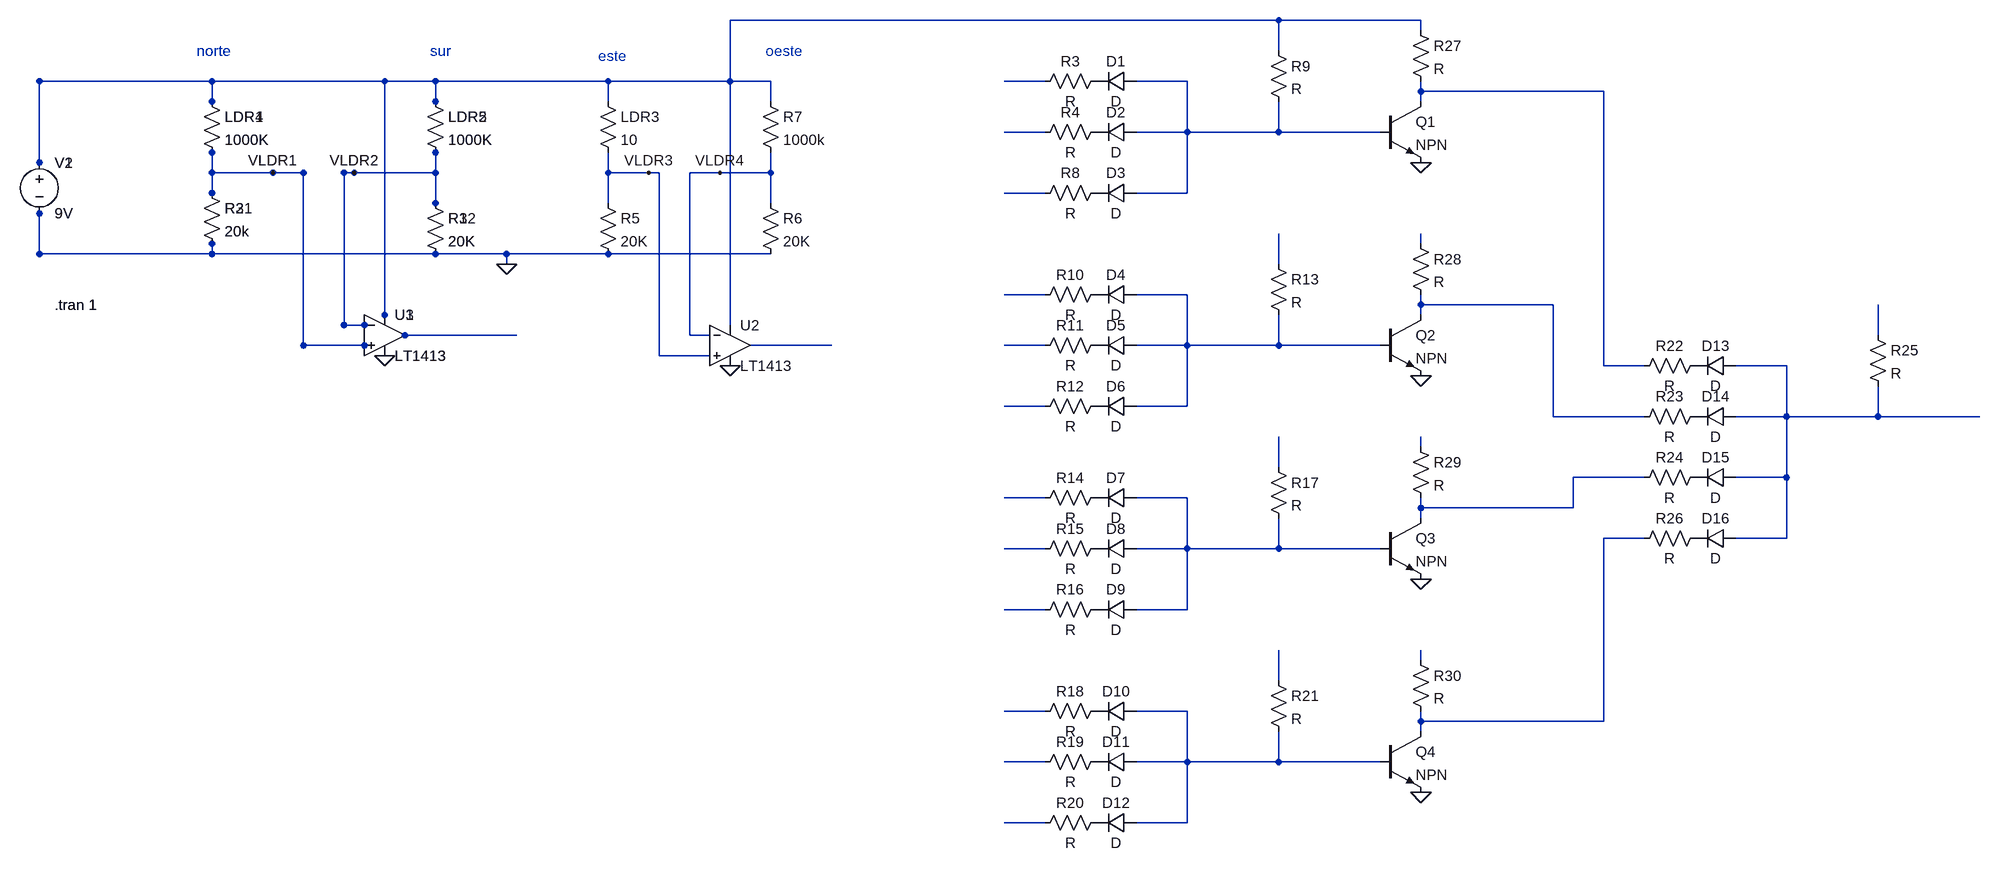
[diagram p0: schematic idea1_tp8.asc]
idea1_tp8.asc, the LTspice schematic file:
Version 4
SHEET 1 3108 1200
WIRE 2000 -112 1136 -112
WIRE 2224 -112 2000 -112
WIRE 2224 -96 2224 -112
WIRE 2000 -64 2000 -112
WIRE 320 -16 48 -16
WIRE 592 -16 320 -16
WIRE 672 -16 592 -16
WIRE 944 -16 672 -16
WIRE 1136 -16 1136 -112
WIRE 1136 -16 944 -16
WIRE 1200 -16 1136 -16
WIRE 1632 -16 1568 -16
WIRE 1856 -16 1776 -16
WIRE 2224 0 2224 -16
WIRE 2512 0 2224 0
WIRE 320 16 320 -16
WIRE 672 16 672 -16
WIRE 944 16 944 -16
WIRE 1200 16 1200 -16
WIRE 2224 16 2224 0
WIRE 1632 64 1568 64
WIRE 1856 64 1856 -16
WIRE 1856 64 1776 64
WIRE 2000 64 2000 16
WIRE 2000 64 1856 64
WIRE 2160 64 2000 64
WIRE 48 112 48 -16
WIRE 320 128 320 96
WIRE 416 128 320 128
WIRE 464 128 416 128
WIRE 544 128 528 128
WIRE 672 128 672 96
WIRE 672 128 544 128
WIRE 944 128 944 96
WIRE 1008 128 944 128
WIRE 1024 128 1008 128
WIRE 1120 128 1072 128
WIRE 1200 128 1200 96
WIRE 1200 128 1120 128
WIRE 320 160 320 128
WIRE 1632 160 1568 160
WIRE 1856 160 1856 64
WIRE 1856 160 1776 160
WIRE 672 176 672 128
WIRE 944 176 944 128
WIRE 1200 176 1200 128
WIRE 2224 240 2224 224
WIRE 48 256 48 192
WIRE 320 256 320 240
WIRE 320 256 48 256
WIRE 672 256 320 256
WIRE 784 256 672 256
WIRE 944 256 784 256
WIRE 1200 256 944 256
WIRE 784 272 784 256
WIRE 2000 272 2000 224
WIRE 1632 320 1568 320
WIRE 1856 320 1776 320
WIRE 2224 336 2224 320
WIRE 2432 336 2224 336
WIRE 592 352 592 -16
WIRE 2224 352 2224 336
WIRE 528 368 528 128
WIRE 560 368 528 368
WIRE 1136 368 1136 -16
WIRE 800 384 624 384
WIRE 1072 384 1072 128
WIRE 1104 384 1072 384
WIRE 2944 384 2944 336
WIRE 464 400 464 128
WIRE 560 400 464 400
WIRE 1296 400 1168 400
WIRE 1632 400 1568 400
WIRE 1856 400 1856 320
WIRE 1856 400 1776 400
WIRE 2000 400 2000 352
WIRE 2000 400 1856 400
WIRE 2160 400 2000 400
WIRE 1024 416 1024 128
WIRE 1104 416 1024 416
WIRE 2512 432 2512 0
WIRE 2576 432 2512 432
WIRE 2800 432 2720 432
WIRE 1632 496 1568 496
WIRE 1856 496 1856 400
WIRE 1856 496 1776 496
WIRE 2432 512 2432 336
WIRE 2576 512 2432 512
WIRE 2800 512 2800 432
WIRE 2800 512 2720 512
WIRE 2944 512 2944 464
WIRE 2944 512 2800 512
WIRE 3104 512 2944 512
WIRE 2224 560 2224 544
WIRE 2000 592 2000 544
WIRE 2576 608 2464 608
WIRE 2800 608 2800 512
WIRE 2800 608 2720 608
WIRE 1632 640 1568 640
WIRE 1856 640 1776 640
WIRE 2224 656 2224 640
WIRE 2464 656 2464 608
WIRE 2464 656 2224 656
WIRE 2224 672 2224 656
WIRE 2576 704 2512 704
WIRE 2800 704 2800 608
WIRE 2800 704 2720 704
WIRE 1632 720 1568 720
WIRE 1856 720 1856 640
WIRE 1856 720 1776 720
WIRE 2000 720 2000 672
WIRE 2000 720 1856 720
WIRE 2160 720 2000 720
WIRE 1632 816 1568 816
WIRE 1856 816 1856 720
WIRE 1856 816 1776 816
WIRE 2224 896 2224 880
WIRE 2000 928 2000 880
WIRE 1632 976 1568 976
WIRE 1856 976 1776 976
WIRE 2224 992 2224 976
WIRE 2512 992 2512 704
WIRE 2512 992 2224 992
WIRE 2224 1008 2224 992
WIRE 1632 1056 1568 1056
WIRE 1856 1056 1856 976
WIRE 1856 1056 1776 1056
WIRE 2000 1056 2000 1008
WIRE 2000 1056 1856 1056
WIRE 2160 1056 2000 1056
WIRE 1632 1152 1568 1152
WIRE 1856 1152 1856 1056
WIRE 1856 1152 1776 1152
WIRE 320 -16 48 -16
WIRE 592 -16 320 -16
WIRE 672 -16 592 -16
WIRE 320 16 320 -16
WIRE 672 16 672 -16
WIRE 48 112 48 -16
WIRE 320 128 320 96
WIRE 416 128 320 128
WIRE 464 128 416 128
WIRE 544 128 528 128
WIRE 672 128 672 96
WIRE 672 128 544 128
WIRE 320 160 320 128
WIRE 672 176 672 128
WIRE 48 256 48 192
WIRE 320 256 320 240
WIRE 320 256 48 256
WIRE 672 256 320 256
WIRE 784 256 672 256
WIRE 784 272 784 256
WIRE 592 352 592 -16
WIRE 528 368 528 128
WIRE 560 368 528 368
WIRE 800 384 624 384
WIRE 464 400 464 128
WIRE 560 400 464 400
FLAG 592 416 0
FLAG 1136 432 0
FLAG 784 272 0
FLAG 416 128 VLDR1
FLAG 544 128 VLDR2
FLAG 1008 128 VLDR3
FLAG 1120 128 VLDR4
FLAG 2224 112 0
FLAG 2224 448 0
FLAG 2224 768 0
FLAG 2224 1104 0
FLAG 592 416 0
FLAG 784 272 0
FLAG 416 128 VLDR1
FLAG 544 128 VLDR2
SYMBOL voltage 48 96 R0
WINDOW 123 0 0 Left 0
WINDOW 39 0 0 Left 0
SYMATTR InstName V1
SYMATTR Value 9V
SYMBOL res 304 0 R0
SYMATTR InstName LDR1
SYMATTR Value 1000K
SYMBOL res 304 144 R0
SYMATTR InstName R2
SYMATTR Value 20k
SYMBOL res 656 160 R0
SYMATTR InstName R1
SYMATTR Value 20K
SYMBOL res 656 0 R0
SYMATTR InstName LDR2
SYMATTR Value 1000K
SYMBOL res 928 0 R0
SYMATTR InstName LDR3
SYMATTR Value 10
SYMBOL res 928 160 R0
SYMATTR InstName R5
SYMATTR Value 20K
SYMBOL res 1184 160 R0
SYMATTR InstName R6
SYMATTR Value 20K
SYMBOL res 1184 0 R0
SYMATTR InstName R7
SYMATTR Value 1000k
SYMBOL OpAmps\\LT1413 592 320 R0
SYMATTR InstName U1
SYMBOL OpAmps\\LT1413 1136 336 R0
SYMATTR InstName U2
SYMBOL res 1728 -32 R90
WINDOW 0 0 56 VBottom 2
WINDOW 3 32 56 VTop 2
SYMATTR InstName R3
SYMBOL diode 1776 -32 R90
WINDOW 0 0 32 VBottom 2
WINDOW 3 32 32 VTop 2
SYMATTR InstName D1
SYMBOL res 1728 48 R90
WINDOW 0 0 56 VBottom 2
WINDOW 3 32 56 VTop 2
SYMATTR InstName R4
SYMBOL diode 1776 48 R90
WINDOW 0 0 32 VBottom 2
WINDOW 3 32 32 VTop 2
SYMATTR InstName D2
SYMBOL res 1728 144 R90
WINDOW 0 0 56 VBottom 2
WINDOW 3 32 56 VTop 2
SYMATTR InstName R8
SYMBOL diode 1776 144 R90
WINDOW 0 0 32 VBottom 2
WINDOW 3 32 32 VTop 2
SYMATTR InstName D3
SYMBOL res 1984 -80 R0
SYMATTR InstName R9
SYMBOL res 1728 304 R90
WINDOW 0 0 56 VBottom 2
WINDOW 3 32 56 VTop 2
SYMATTR InstName R10
SYMBOL diode 1776 304 R90
WINDOW 0 0 32 VBottom 2
WINDOW 3 32 32 VTop 2
SYMATTR InstName D4
SYMBOL res 1728 384 R90
WINDOW 0 0 56 VBottom 2
WINDOW 3 32 56 VTop 2
SYMATTR InstName R11
SYMBOL diode 1776 384 R90
WINDOW 0 0 32 VBottom 2
WINDOW 3 32 32 VTop 2
SYMATTR InstName D5
SYMBOL res 1728 480 R90
WINDOW 0 0 56 VBottom 2
WINDOW 3 32 56 VTop 2
SYMATTR InstName R12
SYMBOL diode 1776 480 R90
WINDOW 0 0 32 VBottom 2
WINDOW 3 32 32 VTop 2
SYMATTR InstName D6
SYMBOL res 1984 256 R0
SYMATTR InstName R13
SYMBOL res 1728 624 R90
WINDOW 0 0 56 VBottom 2
WINDOW 3 32 56 VTop 2
SYMATTR InstName R14
SYMBOL diode 1776 624 R90
WINDOW 0 0 32 VBottom 2
WINDOW 3 32 32 VTop 2
SYMATTR InstName D7
SYMBOL res 1728 704 R90
WINDOW 0 0 56 VBottom 2
WINDOW 3 32 56 VTop 2
SYMATTR InstName R15
SYMBOL diode 1776 704 R90
WINDOW 0 0 32 VBottom 2
WINDOW 3 32 32 VTop 2
SYMATTR InstName D8
SYMBOL res 1728 800 R90
WINDOW 0 0 56 VBottom 2
WINDOW 3 32 56 VTop 2
SYMATTR InstName R16
SYMBOL diode 1776 800 R90
WINDOW 0 0 32 VBottom 2
WINDOW 3 32 32 VTop 2
SYMATTR InstName D9
SYMBOL res 1984 576 R0
SYMATTR InstName R17
SYMBOL res 1728 960 R90
WINDOW 0 0 56 VBottom 2
WINDOW 3 32 56 VTop 2
SYMATTR InstName R18
SYMBOL diode 1776 960 R90
WINDOW 0 0 32 VBottom 2
WINDOW 3 32 32 VTop 2
SYMATTR InstName D10
SYMBOL res 1728 1040 R90
WINDOW 0 0 56 VBottom 2
WINDOW 3 32 56 VTop 2
SYMATTR InstName R19
SYMBOL diode 1776 1040 R90
WINDOW 0 0 32 VBottom 2
WINDOW 3 32 32 VTop 2
SYMATTR InstName D11
SYMBOL res 1728 1136 R90
WINDOW 0 0 56 VBottom 2
WINDOW 3 32 56 VTop 2
SYMATTR InstName R20
SYMBOL diode 1776 1136 R90
WINDOW 0 0 32 VBottom 2
WINDOW 3 32 32 VTop 2
SYMATTR InstName D12
SYMBOL res 1984 912 R0
SYMATTR InstName R21
SYMBOL res 2672 416 R90
WINDOW 0 0 56 VBottom 2
WINDOW 3 32 56 VTop 2
SYMATTR InstName R22
SYMBOL diode 2720 416 R90
WINDOW 0 0 32 VBottom 2
WINDOW 3 32 32 VTop 2
SYMATTR InstName D13
SYMBOL res 2672 496 R90
WINDOW 0 0 56 VBottom 2
WINDOW 3 32 56 VTop 2
SYMATTR InstName R23
SYMBOL diode 2720 496 R90
WINDOW 0 0 32 VBottom 2
WINDOW 3 32 32 VTop 2
SYMATTR InstName D14
SYMBOL res 2672 592 R90
WINDOW 0 0 56 VBottom 2
WINDOW 3 32 56 VTop 2
SYMATTR InstName R24
SYMBOL diode 2720 592 R90
WINDOW 0 0 32 VBottom 2
WINDOW 3 32 32 VTop 2
SYMATTR InstName D15
SYMBOL res 2928 368 R0
SYMATTR InstName R25
SYMBOL res 2672 688 R90
WINDOW 0 0 56 VBottom 2
WINDOW 3 32 56 VTop 2
SYMATTR InstName R26
SYMBOL diode 2720 688 R90
WINDOW 0 0 32 VBottom 2
WINDOW 3 32 32 VTop 2
SYMATTR InstName D16
SYMBOL npn 2160 16 R0
SYMATTR InstName Q1
SYMBOL res 2208 -112 R0
SYMATTR InstName R27
SYMBOL npn 2160 352 R0
SYMATTR InstName Q2
SYMBOL res 2208 224 R0
SYMATTR InstName R28
SYMBOL npn 2160 672 R0
SYMATTR InstName Q3
SYMBOL res 2208 544 R0
SYMATTR InstName R29
SYMBOL npn 2160 1008 R0
SYMATTR InstName Q4
SYMBOL res 2208 880 R0
SYMATTR InstName R30
SYMBOL voltage 48 96 R0
WINDOW 123 0 0 Left 0
WINDOW 39 0 0 Left 0
SYMATTR InstName V2
SYMATTR Value 9V
SYMBOL res 304 0 R0
SYMATTR InstName LDR4
SYMATTR Value 1000K
SYMBOL res 304 144 R0
SYMATTR InstName R31
SYMATTR Value 20k
SYMBOL res 656 160 R0
SYMATTR InstName R32
SYMATTR Value 20K
SYMBOL res 656 0 R0
SYMATTR InstName LDR5
SYMATTR Value 1000K
SYMBOL OpAmps\\LT1413 592 320 R0
SYMATTR InstName U3
TEXT 72 336 Left 2 !.tran 1
TEXT 296 -64 Left 2 ;norte
TEXT 664 -64 Left 2 ;sur
TEXT 928 -56 Left 2 ;este
TEXT 1192 -64 Left 2 ;oeste
TEXT 72 336 Left 2 !.tran 1
TEXT 296 -64 Left 2 ;norte
TEXT 664 -64 Left 2 ;sur

The netlist it stands for:
* idea1_tp8.asc
V1 N001 0 9V
R§LDR1 N001 VLDR1 1000K
R2 VLDR1 0 20k
R1 VLDR2 0 20K
R§LDR2 N001 VLDR2 1000K
R§LDR3 N001 VLDR3 10
R5 VLDR3 0 20K
R6 VLDR4 0 20K
R7 N001 VLDR4 1000k
XU1 VLDR1 VLDR2 N001 0 N012 LT1413  ; pins In+ In- V+ V- OUT
XU2 VLDR3 VLDR4 N001 0 N014 LT1413  ; pins In+ In- V+ V- OUT
R3 P001 N002 R
D1 N003 P001 D
R4 P002 N005 R
D2 N003 P002 D
R8 P003 N006 R
D3 N003 P003 D
R9 N001 N003 R
R10 P004 N009 R
D4 N010 P004 D
R11 P005 N015 R
D5 N010 P005 D
R12 P006 N017 R
D6 N010 P006 D
R13 N008 N010 R
R14 P007 N021 R
D7 N022 P007 D
R15 P008 N024 R
D8 N022 P008 D
R16 P009 N025 R
D9 N022 P009 D
R17 N019 N022 R
R18 P010 N028 R
D10 N029 P010 D
R19 P011 N030 R
D11 N029 P011 D
R20 P012 N031 R
D12 N029 P012 D
R21 N027 N029 R
R22 P013 N004 R
D13 N016 P013 D
R23 P014 N011 R
D14 N016 P014 D
R24 P015 N020 R
D15 N016 P015 D
R25 N013 N016 R
R26 P016 N023 R
D16 N016 P016 D
Q1 N004 N003 0 0 NPN
R27 N001 N004 R
Q2 N011 N010 0 0 NPN
R28 N007 N011 R
Q3 N020 N022 0 0 NPN
R29 N018 N020 R
Q4 N023 N029 0 0 NPN
R30 N026 N023 R
V2 N001 0 9V
R§LDR4 N001 VLDR1 1000K
R31 VLDR1 0 20k
R32 VLDR2 0 20K
R§LDR5 N001 VLDR2 1000K
XU3 VLDR1 VLDR2 N001 0 N012 LT1413  ; pins In+ In- V+ V- OUT
.model D D
.lib standard.dio
.model NPN NPN
.model PNP PNP
.lib standard.bjt
.tran 1
* norte
* sur
* este
* oeste
.tran 1
* norte
* sur
.lib LTC.lib
.backanno
.end